# Altium schematic sheet 3_MCU.SchDoc
size A4; SheetNumber: 4; SheetTotal: 6
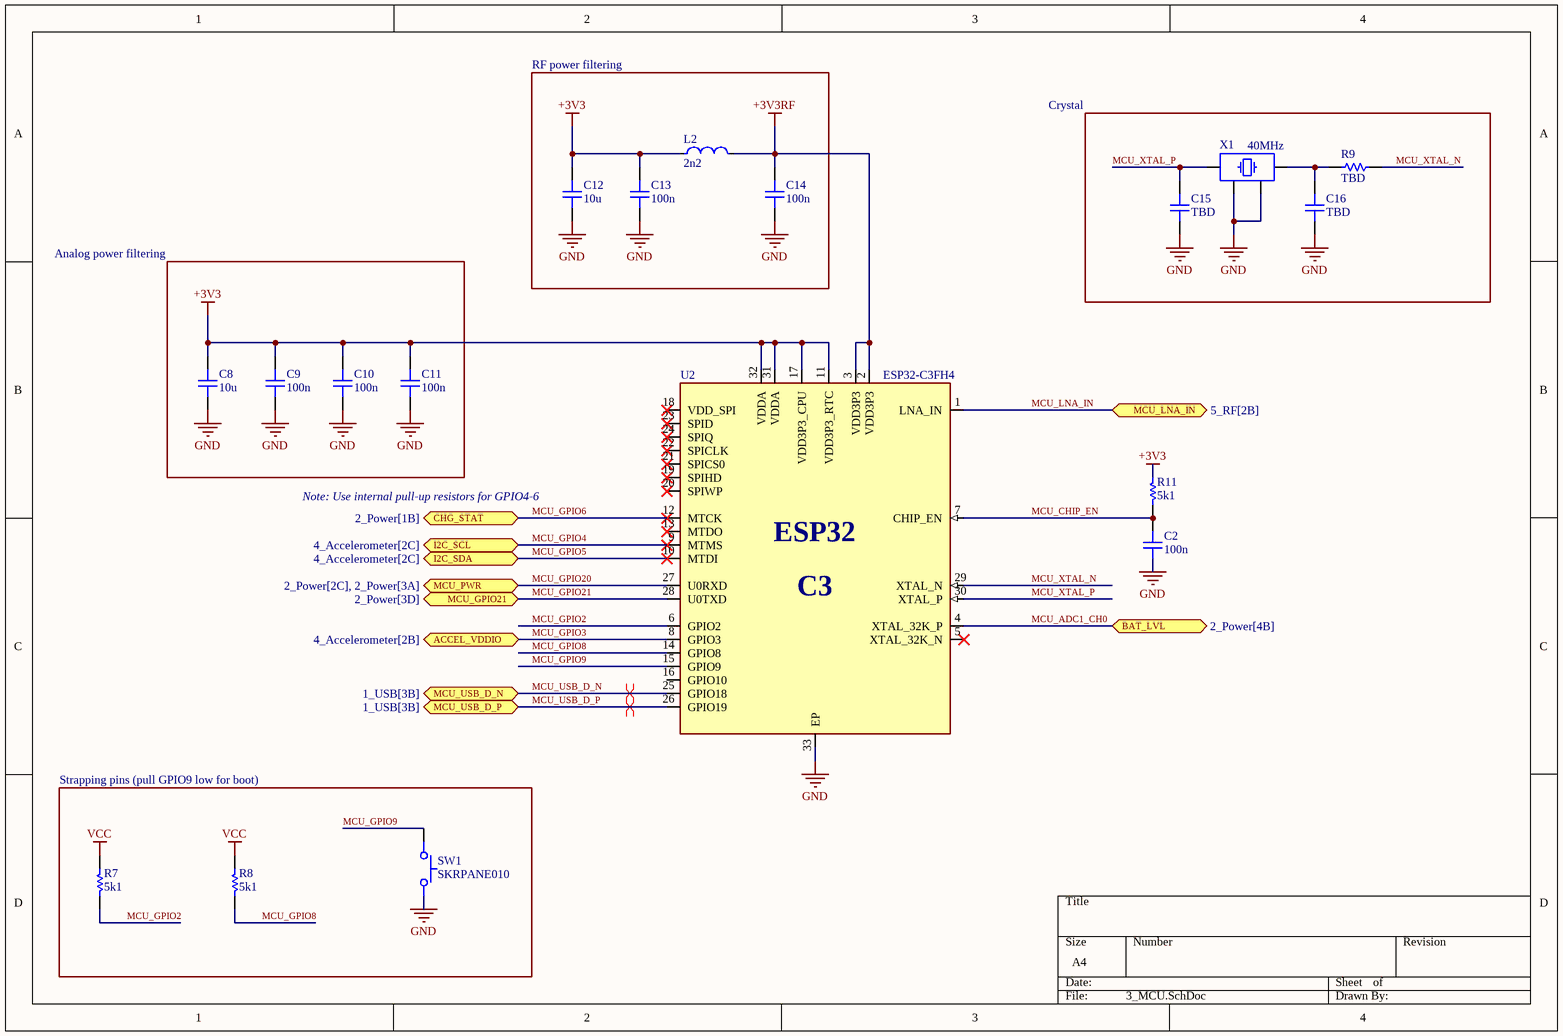
[diagram p0: 3_MCU.SchDoc]

## Parts
C2  100n  [CAP_0402]
C8  10u  [CAP_0402]
C9  100n  [CAP_0402]
C10  100n  [CAP_0402]
C11  100n  [CAP_0402]
C12  10u  [CAP_0402]
C13  100n  [CAP_0402]
C14  100n  [CAP_0402]
C15  TBD  [CAP_0402]
C16  TBD  [CAP_0402]
L2  2n2  [FP-LQW15AN_80-MFG]
R7  5k1  [RESC1005X40X25ML10T10]
R8  5k1  [RESC1005X40X25ML10T10]
R9  TBD  [RES_0402]
R11  5k1  [RESC1005X40X25ML10T10]
SW1  SKRPANE010  [SKRPANE010]
U2  ESP32-C3FH4  [QFN32-5x5]
X1  40MHz  [XTAL_2520]

## Blocks framed on the sheet
RF power filtering: C12-C14 L2
Crystal: C15 C16 R9 X1
Analog power filtering: C8-C11
Strapping pins (pull GPIO9 low for boot): R7 R8 SW1

## Ports
ACCEL_VDDIO (bidir, see 4_Accelerometer[2B]), BAT_LVL (bidir, see 2_Power[4B]), CHG_STAT (bidir, see 2_Power[1B]), I2C_SCL (bidir, see 4_Accelerometer[2C]), I2C_SDA (bidir, see 4_Accelerometer[2C]), MCU_GPIO21 (bidir, see 2_Power[3D]), MCU_LNA_IN (bidir, see 5_RF[2B]), MCU_PWR (bidir, see 2_Power[2C], 2_Power[3A]), MCU_USB_D_N (bidir, see 1_USB[3B]), MCU_USB_D_P (bidir, see 1_USB[3B])

## Nets
+3V3: C8.2 C9.2 C10.2 C11.2 C12.2 C13.2 L2.1 R11.1 U2.11(VDD3P3_RTC) U2.17(VDD3P3_CPU) U2.31(VDDA) U2.32(VDDA)
+3V3RF: C14.2 L2.2 U2.2(VDD3P3) U2.3(VDD3P3)
GND: C2.2 C8.1 C9.1 C10.1 C11.1 C12.1 C13.1 C14.1 C15.1 C16.1 SW1.12 U2.33(EP) X1.2 X1.4
VCC: R7.2 R8.2
MCU_ADC1_CH0: U2.4(XTAL_32K_P) ; port BAT_LVL
MCU_CHIP_EN: C2.1 R11.2 U2.7(CHIP_EN)
MCU_GPIO2: R7.1 U2.6(GPIO2)
MCU_GPIO3: U2.8(GPIO3) ; port ACCEL_VDDIO
MCU_GPIO4: U2.9(MTMS) ; port I2C_SCL
MCU_GPIO5: U2.10(MTDI) ; port I2C_SDA
MCU_GPIO6: U2.12(MTCK) ; port CHG_STAT
MCU_GPIO8: R8.1 U2.14(GPIO8)
MCU_GPIO9: SW1.34 U2.15(GPIO9)
MCU_GPIO20: U2.27(U0RXD) ; port MCU_PWR
MCU_GPIO21: U2.28(U0TXD) ; port MCU_GPIO21
MCU_LNA_IN: U2.1(LNA_IN) ; port MCU_LNA_IN
MCU_USB_D_N: U2.25(GPIO18) ; port MCU_USB_D_N
MCU_USB_D_P: U2.26(GPIO19) ; port MCU_USB_D_P
MCU_XTAL_N: R9.2 U2.29(XTAL_N)
MCU_XTAL_P: C15.2 U2.30(XTAL_P) X1.1
NetC16_2: C16.2 R9.1 X1.3

Not connected (* = marked no-connect by the designer): U2 5(XTAL_32K_N)* 13(MTDO)* 16(GPIO10) 18(VDD_SPI)* 19(SPIHD)* 20(SPIWP)* 21(SPICS0)* 22(SPICLK)* 23(SPID)* 24(SPIQ)*

## Layout directives
differential pair: MCU_USB_D_N, MCU_USB_D_P

## Notes on the sheet
- Note: Use internal pull-up resistors for GPIO4-6
- (in symbol ESP32-C3) ESP32; C3

## Library data of the parts
C2 C9-C11 C13 C14 = CAP_0402_16V: Capacitor SMD 0402 16V; Supplier 1: Mouser; Supplier Part Number 1: 187-CL05A104KP5NNND
C8 C12 C15 C16 = CAP_0402_10V: Capacitor SMD 0402 10V
  C8 C12: Supplier 1: Arrow Electronics; Supplier Part Number 1: GRM155R61A106ME11D
L2 = CMP-06042-014713-1: Wire Wound RF Inductor 2.2nH ±2% 2530mA 0.022Ω 0402 (1005)
R7 R8 R11 = CMP-2002-03675-1: Part Number: RK73B1ETTP512J; Manufacturer: KOA Speer
R9 = RES_0402: Resistor SMD 0402; Manufacturer: *; Manufacturer Part Number: *; Distributor Link: *
SW1 = SKRPANE010: Tactile Switch SMD SPST; Manufacturer: Alps Alpine; Manufacturer Part Number: SKRPANE010; Supplier 1: Mouser; Supplier Part Number 1: 688-SKRPANE010
U2 = ESP32-C3: Ultra­Low­Power SoC with RISC­V Single­Core CPU Supporting IEEE 802.11b/g/n (2.4 GHz Wi­Fi) and Bluetooth® 5 (LE); Manufacturer: Espressif; Manufacturer Part Number: ESP32-C3; LCSC: C2838500; Supplier 1: Digi-Key; Supplier Part Number 1: 1904-ESP32-C3FH4CT-ND
X1 = XTAL_2520: Crystal SMD 2520; Distributor Link: *; Supplier 1: Farnell; Supplier Part Number 1: 4072596